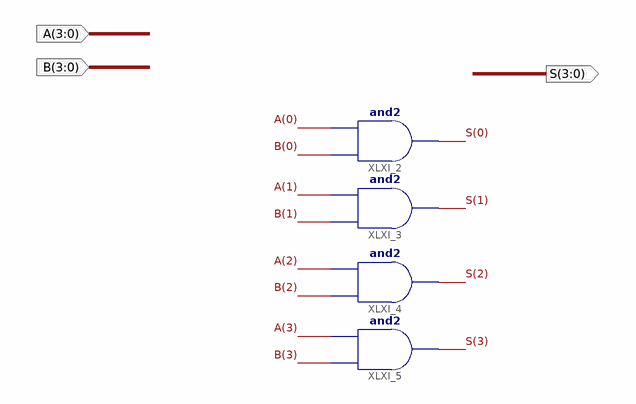
[diagram p0: schematic sheet 1]
// Xilinx ISE schematic AndGate.sch (xa9500xl) as structural Verilog: 4 symbols, 3 ports
module AndGate (
  input  [3:0] A,
  input  [3:0] B,
  output [3:0] S
);

  and XLXI_2 (S[0], B[0], A[0]);
  and XLXI_3 (S[1], B[1], A[1]);
  and XLXI_4 (S[2], B[2], A[2]);
  and XLXI_5 (S[3], B[3], A[3]);
endmodule
